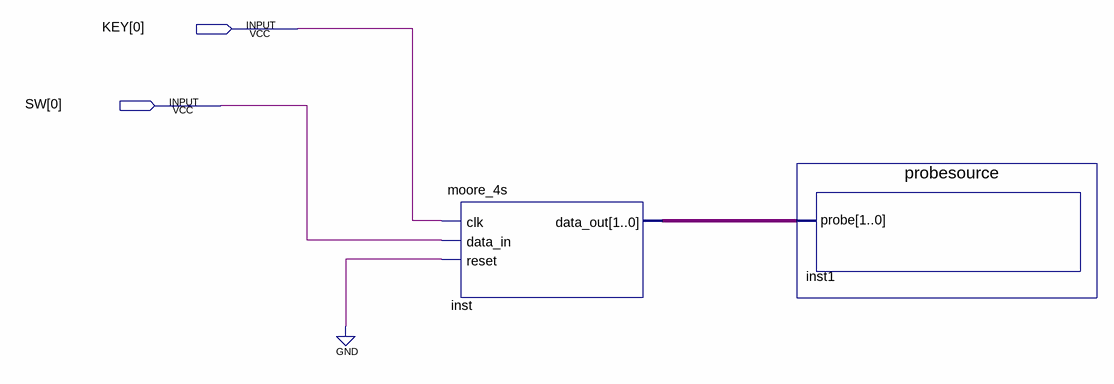
[diagram p0: schematic sheet]
// Quartus schematic Block1.bdf as structural Verilog: 2 symbols, 2 pins
module Block1 (
  input  [0:0] KEY,
  input  [0:0] SW
);

  wire [1:0] inst_data_out;

  moore_4s inst (.clk(KEY[0]), .data_in(SW[0]), .reset(1'b0), .data_out(inst_data_out));
  probesource inst1 (.probe(inst_data_out));
endmodule
